# EasyEDA Pro project FIANO.eprj

# Schematic Schematic
Board Name: Split; Create Date: 2024-10-06; Page Name: Schematic; Project Name: FIANO; Schematic Name: Schematic; Update Date: 2024-10-06; File: Plan; Id: /; Sheet: /
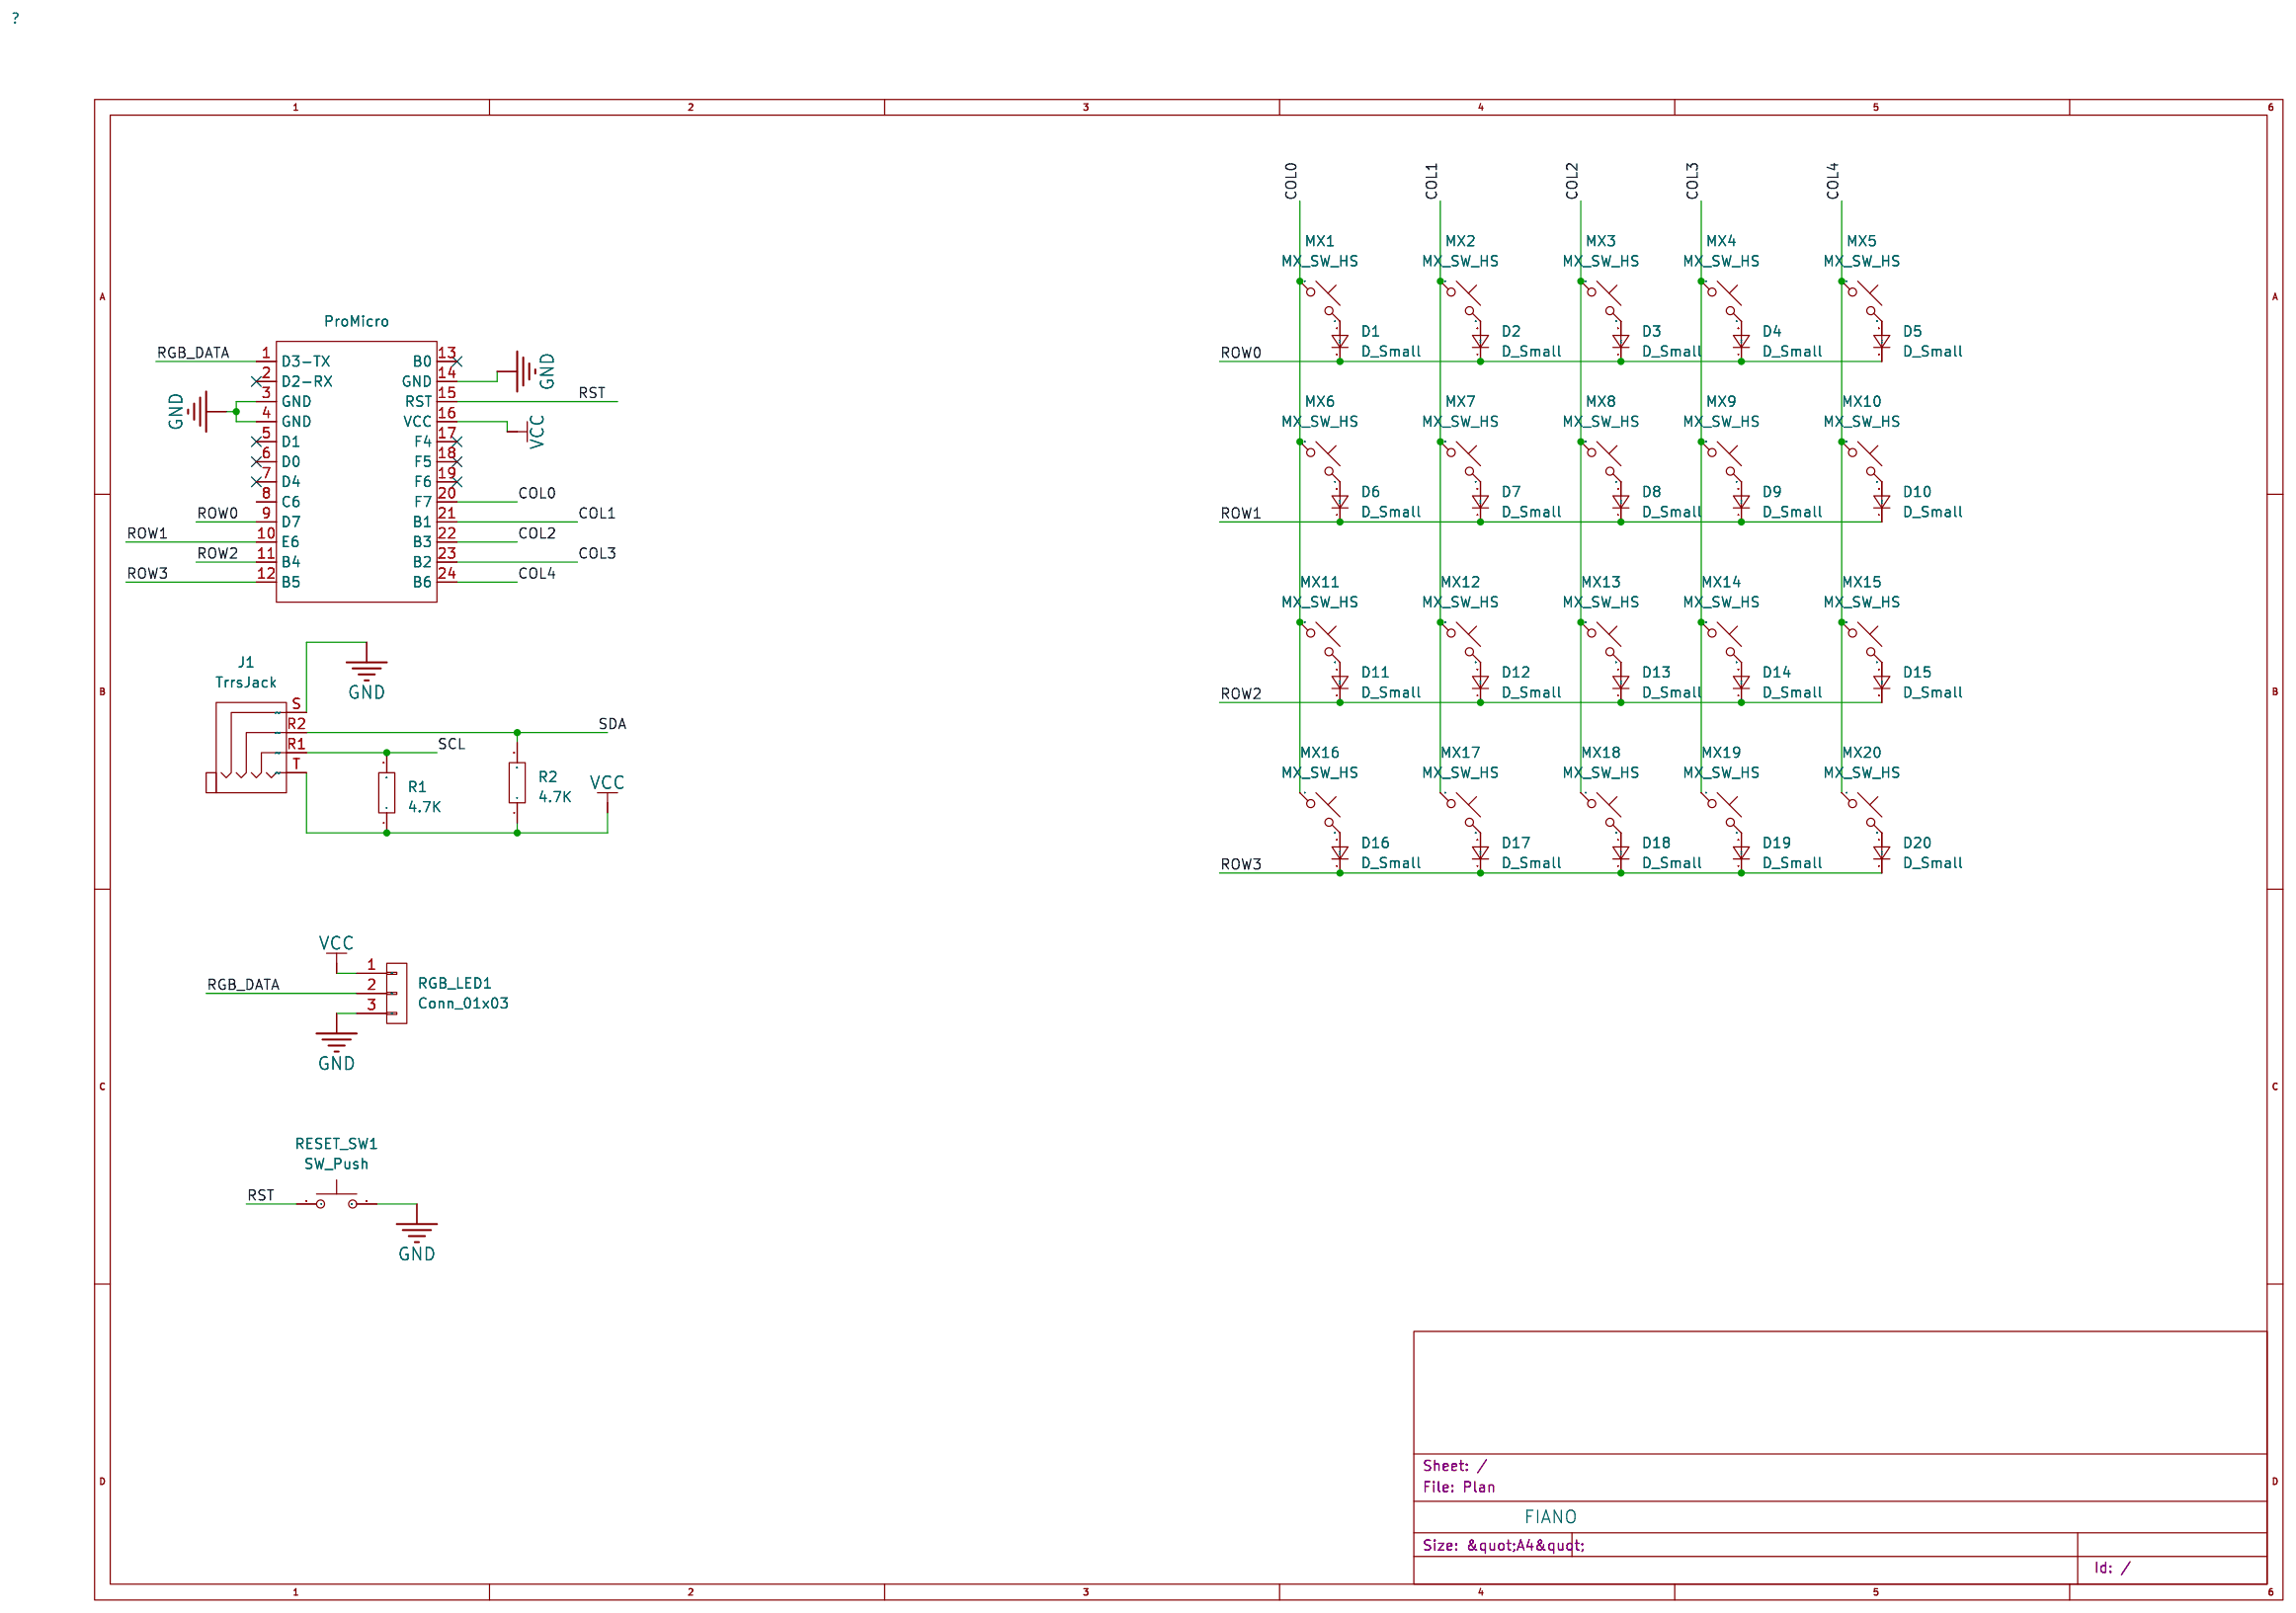
[diagram p0: schematic sheet]

## Parts
D1  D_Small  [Diode_SMD:D_SOD-123]
D2  D_Small  [Diode_SMD:D_SOD-123]
D3  D_Small  [Diode_SMD:D_SOD-123]
D4  D_Small  [Diode_SMD:D_SOD-123]
D5  D_Small  [Diode_SMD:D_SOD-123]
D6  D_Small  [Diode_SMD:D_SOD-123]
D7  D_Small  [Diode_SMD:D_SOD-123]
D8  D_Small  [Diode_SMD:D_SOD-123]
D9  D_Small  [Diode_SMD:D_SOD-123]
D10  D_Small  [Diode_SMD:D_SOD-123]
D11  D_Small  [Keebio-Parts.pretty-master:Diode-hybrid-3pad]
D12  D_Small  [Diode_SMD:D_SOD-123]
D13  D_Small  [Diode_SMD:D_SOD-123]
D14  D_Small  [Diode_SMD:D_SOD-123]
D15  D_Small  [Diode_SMD:D_SOD-123]
D16  D_Small  [Diode_SMD:D_SOD-123]
D17  D_Small  [Diode_SMD:D_SOD-123]
D18  D_Small  [Diode_SMD:D_SOD-123]
D19  D_Small  [Diode_SMD:D_SOD-123]
D20  D_Small  [Diode_SMD:D_SOD-123]
J1  TrrsJack  [PCM_marbastlib-xp-various:CON_MJ-4PP-9]
MX1  MX_SW_HS  [PCM_marbastlib-mx:SW_MX_1u]
MX2  MX_SW_HS  [PCM_marbastlib-mx:SW_MX_1u]
MX3  MX_SW_HS  [PCM_marbastlib-mx:SW_MX_1u]
MX4  MX_SW_HS  [PCM_marbastlib-mx:SW_MX_1u]
MX5  MX_SW_HS  [PCM_marbastlib-mx:SW_MX_1u]
MX6  MX_SW_HS  [PCM_marbastlib-mx:SW_MX_1u]
MX7  MX_SW_HS  [PCM_marbastlib-mx:SW_MX_1u]
MX8  MX_SW_HS  [PCM_marbastlib-mx:SW_MX_1u]
MX9  MX_SW_HS  [PCM_marbastlib-mx:SW_MX_1u]
MX10  MX_SW_HS  [PCM_marbastlib-mx:SW_MX_1u]
MX11  MX_SW_HS  [PCM_marbastlib-mx:SW_MX_1u]
MX12  MX_SW_HS  [PCM_marbastlib-mx:SW_MX_1u]
MX13  MX_SW_HS  [PCM_marbastlib-mx:SW_MX_1u]
MX14  MX_SW_HS  [PCM_marbastlib-mx:SW_MX_1u]
MX15  MX_SW_HS  [PCM_marbastlib-mx:SW_MX_1u]
MX16  MX_SW_HS  [PCM_marbastlib-mx:SW_MX_1u]
MX17  MX_SW_HS  [PCM_marbastlib-mx:SW_MX_1u]
MX18  MX_SW_HS  [PCM_marbastlib-mx:SW_MX_1u]
MX19  MX_SW_HS  [PCM_marbastlib-mx:SW_MX_1u]
MX20  MX_SW_HS  [PCM_marbastlib-mx:SW_MX_1u]
R1  4.7K  [R0603]
R2  4.7K  [R0603]
RESET_SW1  SW_Push
RGB_LED1  Conn_01x03
U1  ProMicro  [PCM_marbastlib-xp-promicroish:ProMicro_USBup]

## Library data of the parts
D1-D20 = Device_D_Small: Diode, small symbol; Sim_Device: D; Sim_Pins: 1=K 2=A; Sim.Device: D; Sim.Pins: 1=K 2=A
J1 = Connector_Audio_AudioJack4: Audio Jack, 4 Poles (TRRS)
MX1-MX20 = PCM_marbastlib-mx_MX_SW_HS_CPG151101S11: Push button switch, normally open, two pins, 45° tilted, Kailh CPG151101S11 for Cherry MX style switches
R1 R2 = Res_0603: Supplier Footprint: 0603
RESET_SW1 = Switch_SW_Push: Push button switch, generic, two pins
RGB_LED1 = Connector_Generic_Conn_01x03: Generic connector, single row, 01x03, script generated (kicad-library-utils/schlib/autogen/connector/)
U1 = PCM_marbastlib-promicroish_Arduino_ProMicro: Symbol for an Arduino Pro Micro

## Nets
GND: J1.S RESET_SW1.2 RGB_LED1.3(Pin) U1.3(GND) U1.4(GND) U1.14(GND)
VCC: J1.T R1.1 R2.1 RGB_LED1.1(Pin) U1.16(VCC)
COL0: MX1.1 MX6.1 MX11.1 MX16.1 U1.20(F7)
COL1: MX2.1 MX7.1 MX12.1 MX17.1 U1.21(B1)
COL2: MX3.1 MX8.1 MX13.1 MX18.1 U1.22(B3)
COL3: MX4.1 MX9.1 MX14.1 MX19.1 U1.23(B2)
COL4: MX5.1 MX10.1 MX15.1 MX20.1 U1.24(B6)
RGB_DATA: RGB_LED1.2(Pin) U1.1(D3-TX)
ROW0: D1.1(K) D2.1(K) D3.1(K) D4.1(K) D5.1(K) U1.9(D7)
ROW1: D6.1(K) D7.1(K) D8.1(K) D9.1(K) D10.1(K) U1.10(E6)
ROW2: D11.1(K) D12.1(K) D13.1(K) D14.1(K) D15.1(K) U1.11(B4)
ROW3: D16.1(K) D17.1(K) D18.1(K) D19.1(K) D20.1(K) U1.12(B5)
RST: RESET_SW1.1 U1.15(RST)
SCL: J1.R1 R1.2
SDA: J1.R2 R2.2
Net-(D1-2): D1.2(A) MX1.2
Net-(D2-2): D2.2(A) MX2.2
Net-(D3-2): D3.2(A) MX3.2
Net-(D4-2): D4.2(A) MX4.2
Net-(D5-2): D5.2(A) MX5.2
Net-(D6-2): D6.2(A) MX6.2
Net-(D7-2): D7.2(A) MX7.2
Net-(D8-2): D8.2(A) MX8.2
Net-(D9-2): D9.2(A) MX9.2
Net-(D10-2): D10.2(A) MX10.2
Net-(D11-2): D11.2(A) MX11.2
Net-(D12-2): D12.2(A) MX12.2
Net-(D13-2): D13.2(A) MX13.2
Net-(D14-2): D14.2(A) MX14.2
Net-(D15-2): D15.2(A) MX15.2
Net-(D16-2): D16.2(A) MX16.2
Net-(D17-2): D17.2(A) MX17.2
Net-(D18-2): D18.2(A) MX18.2
Net-(D19-2): D19.2(A) MX19.2
Net-(D20-2): D20.2(A) MX20.2

Not connected (* = marked no-connect by the designer): U1 2(D2-RX)* 5(D1)* 6(D0)* 7(D4)* 8(C6) 13(B0)* 17(F4)* 18(F5)* 19(F6)*

## Notes on the sheet
- FIANO

# Board Plan
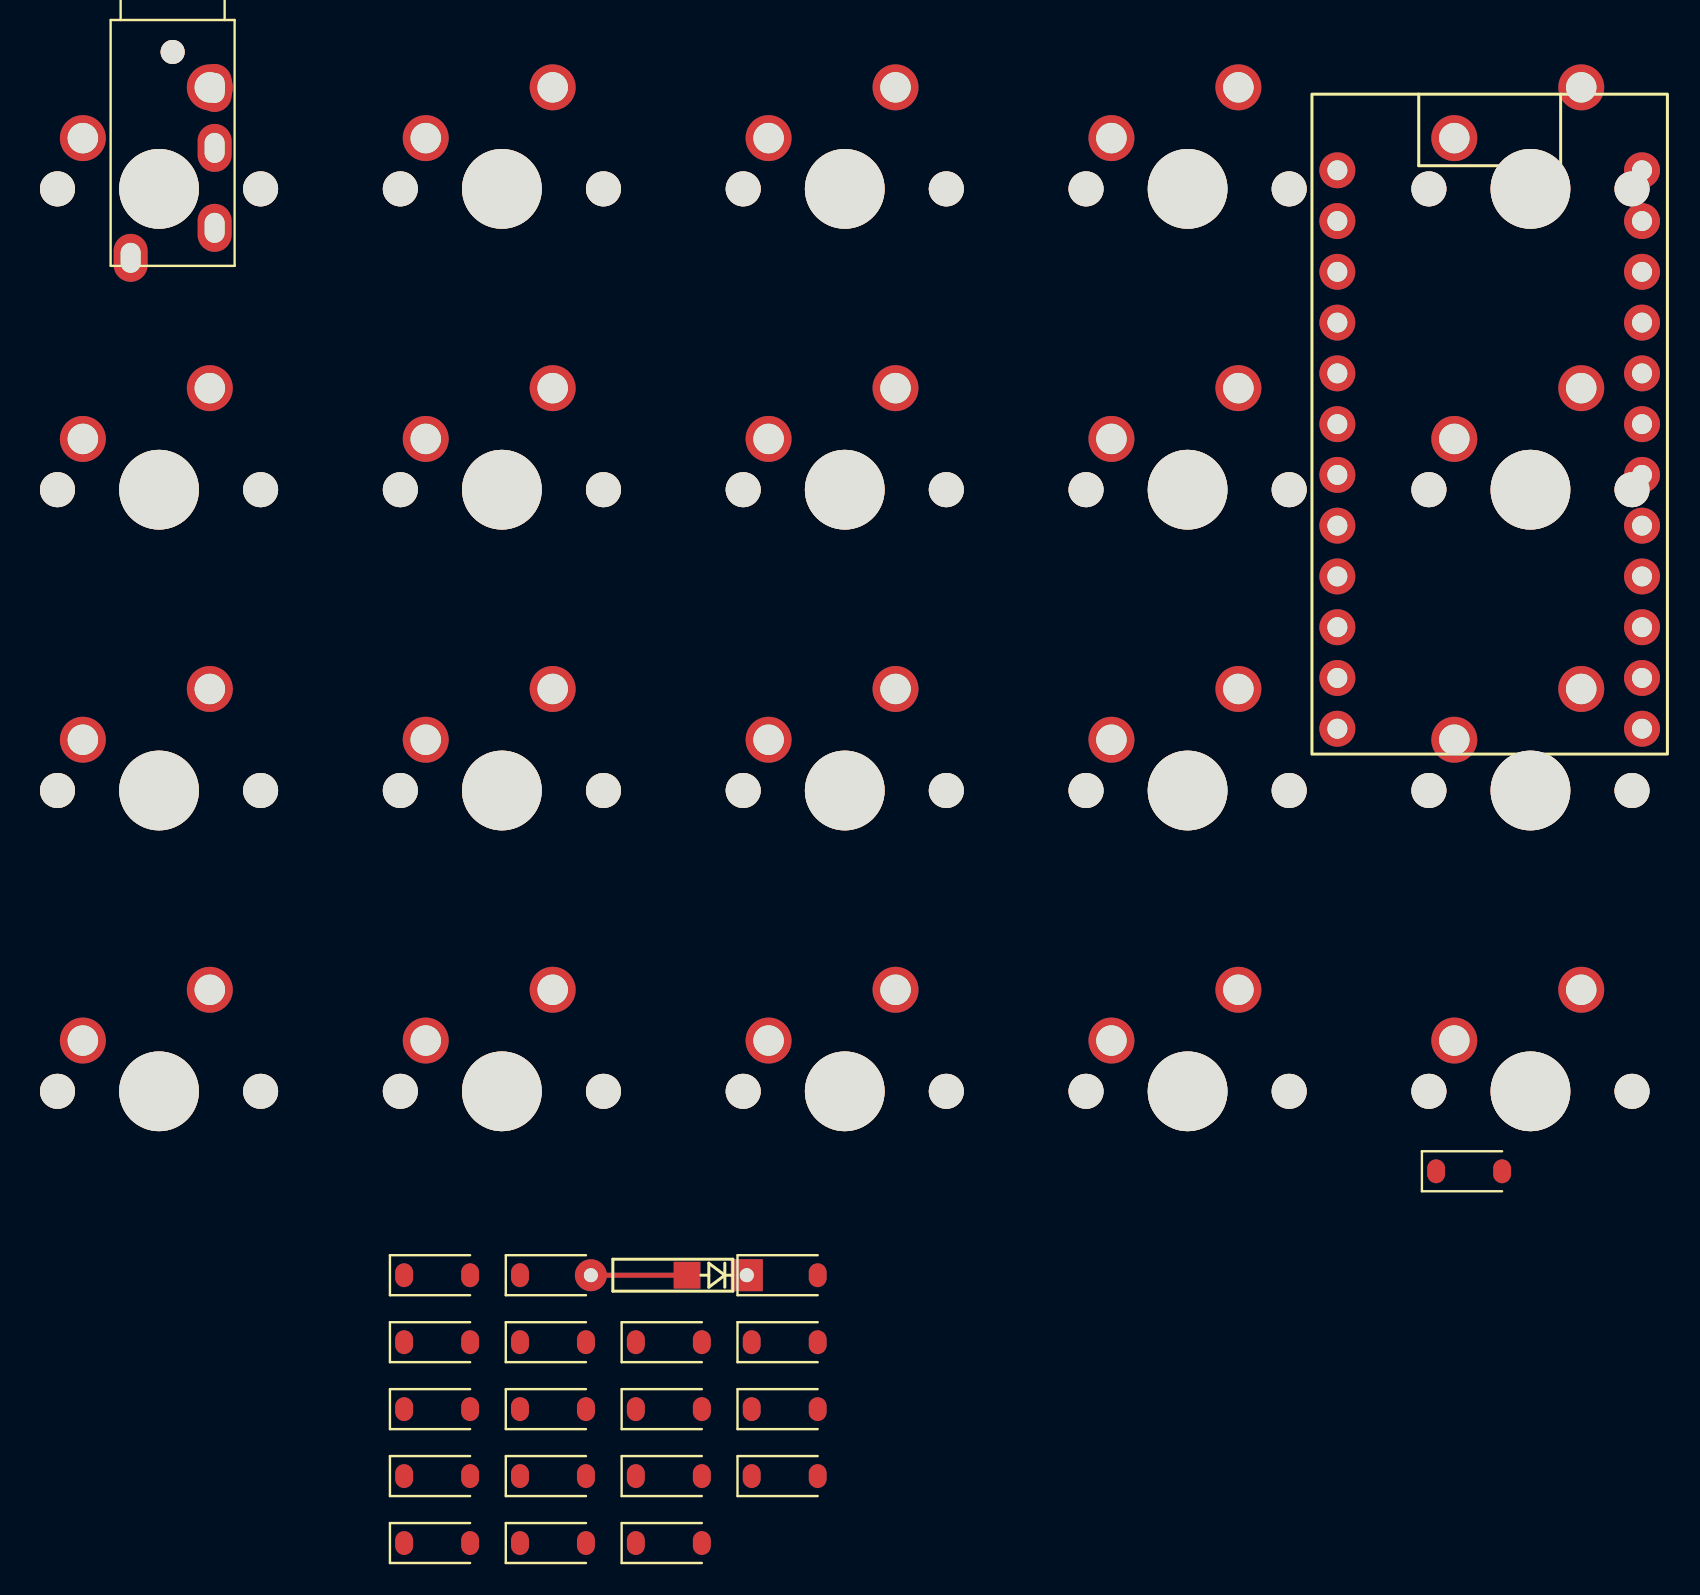
[diagram p1: board, top side]
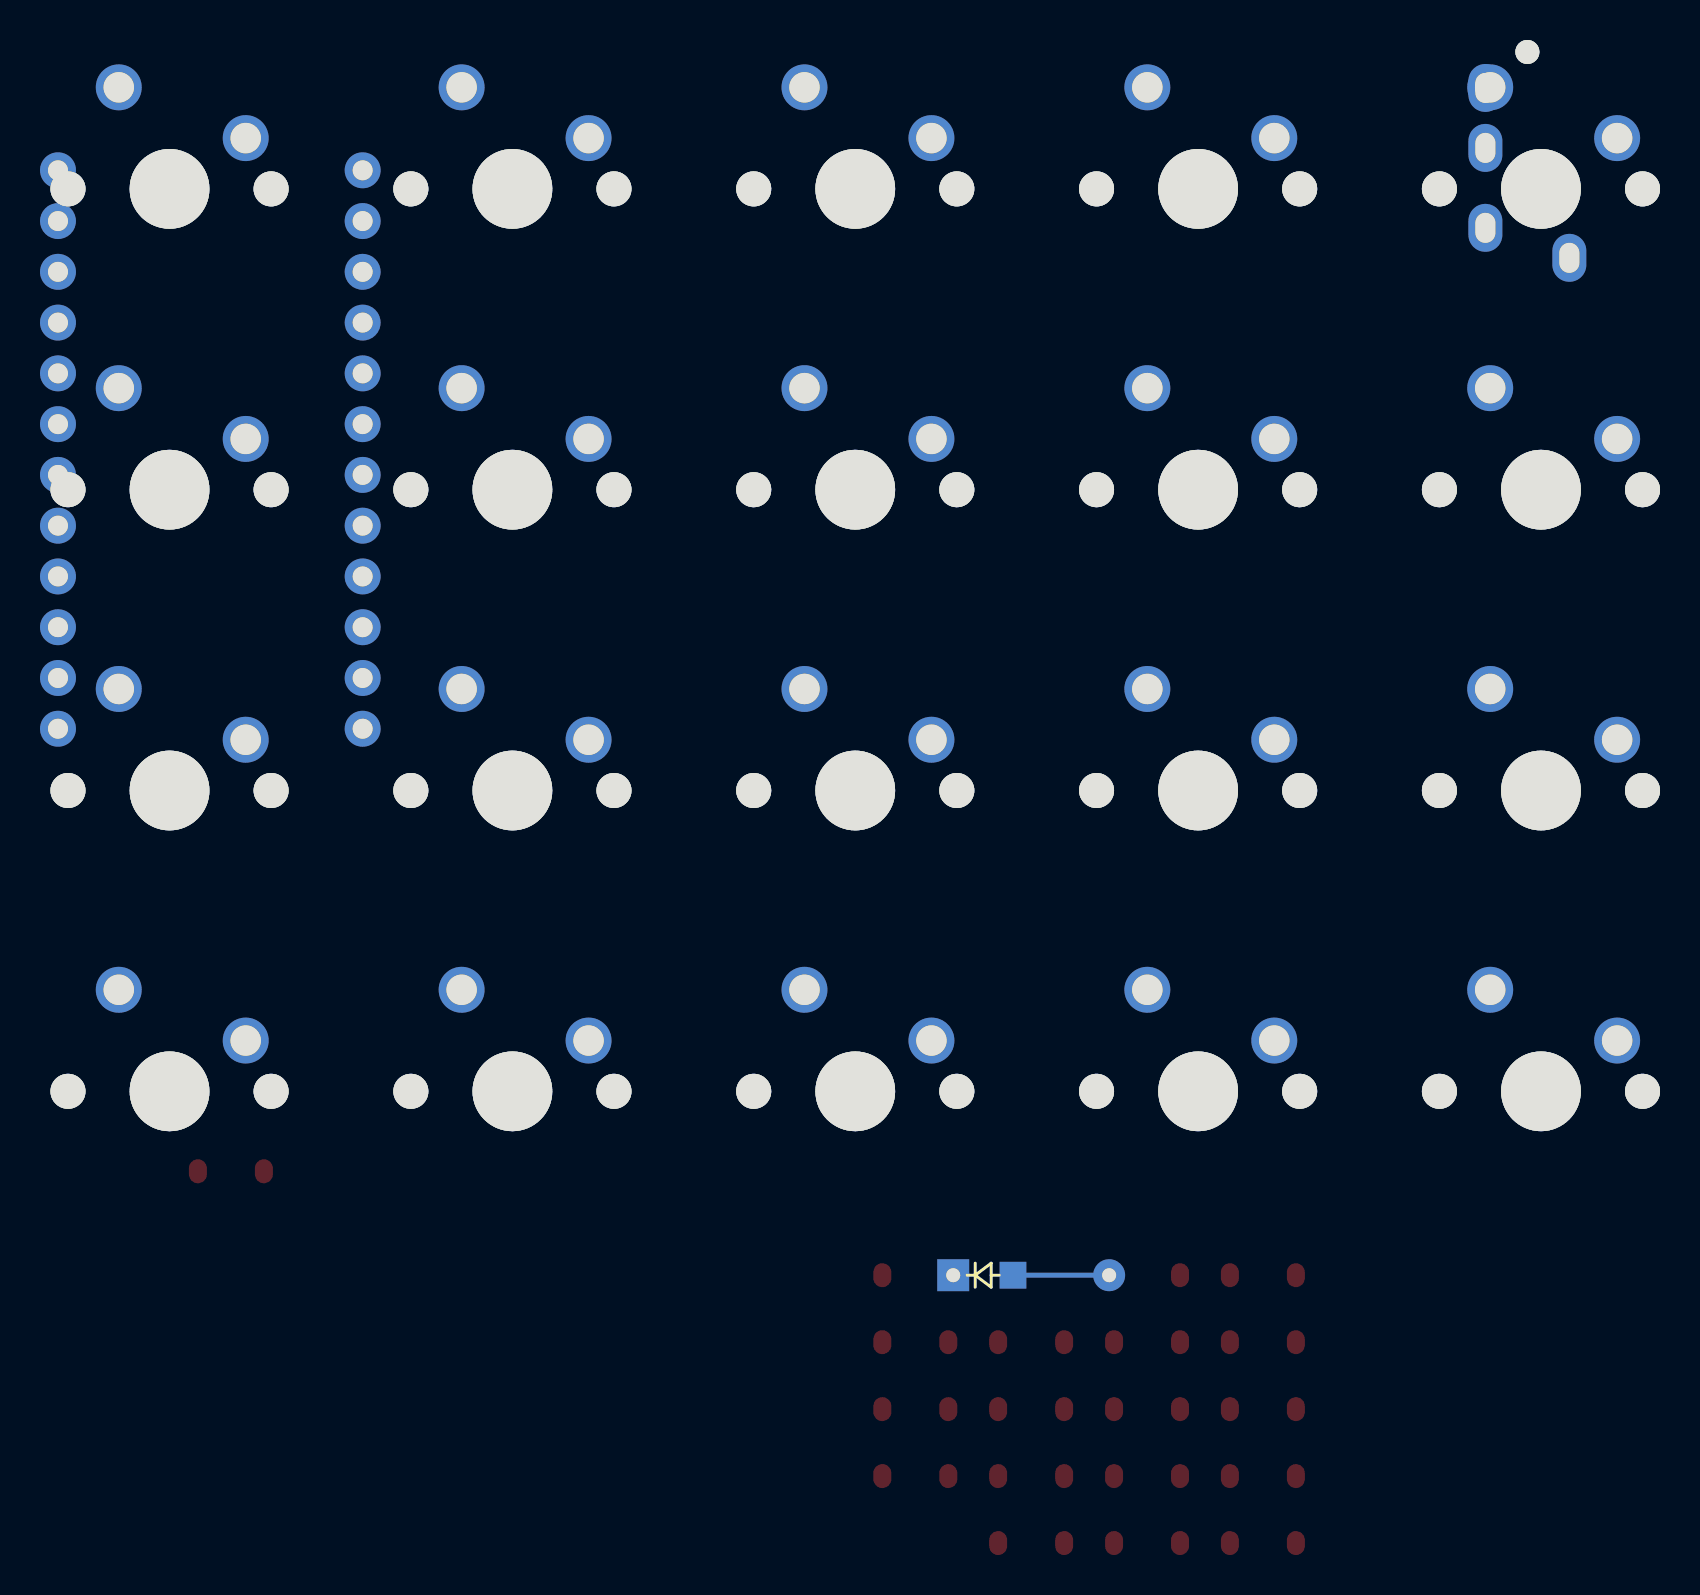
[diagram p2: board, bottom side, seen from below]

No outline. copper layers: Top Layer, Bottom Layer. Coordinates in mm from the lowest, leftmost part position.

## Design rules (mm)
spacing safeClearance (default): track to track 0, other pairs 0 to 0.5

## Placement (name value [footprint] x y rotation side)
D1  D_Small  [Diode_SMD:D_SOD-123]  13.91 13.4 0 top
D2  D_Small  [Diode_SMD:D_SOD-123]  13.91 10.05 0 top
D3  D_Small  [Diode_SMD:D_SOD-123]  13.91 6.7 0 top
D4  D_Small  [Diode_SMD:D_SOD-123]  13.91 3.35 0 top
D5  D_Small  [Diode_SMD:D_SOD-123]  13.91 0 0 top
D6  D_Small  [Diode_SMD:D_SOD-123]  19.7 13.4 0 top
D7  D_Small  [Diode_SMD:D_SOD-123]  19.7 10.05 0 top
D8  D_Small  [Diode_SMD:D_SOD-123]  19.7 6.7 0 top
D9  D_Small  [Diode_SMD:D_SOD-123]  19.7 3.35 0 top
D10  D_Small  [Diode_SMD:D_SOD-123]  19.7 0 0 top
D11  D_Small  [Keebio-Parts.pretty-master:Diode-hybrid-3pad]  25.5 13.4 0 top
D12  D_Small  [Diode_SMD:D_SOD-123]  25.5 10.05 0 top
D13  D_Small  [Diode_SMD:D_SOD-123]  25.5 6.7 0 top
D14  D_Small  [Diode_SMD:D_SOD-123]  25.5 3.35 0 top
D15  D_Small  [Diode_SMD:D_SOD-123]  25.5 0 0 top
D16  D_Small  [Diode_SMD:D_SOD-123]  31.3 13.4 0 top
D17  D_Small  [Diode_SMD:D_SOD-123]  31.3 10.05 0 top
D18  D_Small  [Diode_SMD:D_SOD-123]  31.3 6.7 0 top
D19  D_Small  [Diode_SMD:D_SOD-123]  31.3 3.35 0 top
D20  D_Small  [Diode_SMD:D_SOD-123]  65.53 18.6 0 top
J1  AudioJack4  [PCM_marbastlib-xp-various:CON_MJ-4PP-9]  0.68 70.05 270 top
MX1  MX_SW_HS  [PCM_marbastlib-mx:SW_MX_1u]  0 67.75 0 top
MX2  MX_SW_HS  [PCM_marbastlib-mx:SW_MX_1u]  0 52.7 0 top
MX3  MX_SW_HS  [PCM_marbastlib-mx:SW_MX_1u]  0 37.65 0 top
MX4  MX_SW_HS  [PCM_marbastlib-mx:SW_MX_1u]  0 22.6 0 top
MX5  MX_SW_HS  [PCM_marbastlib-mx:SW_MX_1u]  17.15 67.75 0 top
MX6  MX_SW_HS  [PCM_marbastlib-mx:SW_MX_1u]  17.15 52.7 0 top
MX7  MX_SW_HS  [PCM_marbastlib-mx:SW_MX_1u]  17.15 37.65 0 top
MX8  MX_SW_HS  [PCM_marbastlib-mx:SW_MX_1u]  17.15 22.6 0 top
MX9  MX_SW_HS  [PCM_marbastlib-mx:SW_MX_1u]  34.3 67.75 0 top
MX10  MX_SW_HS  [PCM_marbastlib-mx:SW_MX_1u]  34.3 52.7 0 top
MX11  MX_SW_HS  [PCM_marbastlib-mx:SW_MX_1u]  34.3 37.65 0 top
MX12  MX_SW_HS  [PCM_marbastlib-mx:SW_MX_1u]  34.3 22.6 0 top
MX13  MX_SW_HS  [PCM_marbastlib-mx:SW_MX_1u]  51.45 67.75 0 top
MX14  MX_SW_HS  [PCM_marbastlib-mx:SW_MX_1u]  51.45 52.7 0 top
MX15  MX_SW_HS  [PCM_marbastlib-mx:SW_MX_1u]  51.45 37.65 0 top
MX16  MX_SW_HS  [PCM_marbastlib-mx:SW_MX_1u]  51.45 22.6 0 top
MX17  MX_SW_HS  [PCM_marbastlib-mx:SW_MX_1u]  68.6 67.75 0 top
MX18  MX_SW_HS  [PCM_marbastlib-mx:SW_MX_1u]  68.6 52.7 0 top
MX19  MX_SW_HS  [PCM_marbastlib-mx:SW_MX_1u]  68.6 37.65 0 top
MX20  MX_SW_HS  [PCM_marbastlib-mx:SW_MX_1u]  68.6 22.6 0 top
U2  ProMicro  [PCM_marbastlib-xp-promicroish:ProMicro_USBup]  66.56 54.71 0 top

## Footprints (pads in the part's own frame, mm; a bottom-side part is the same pattern mirrored in y, then rotated)
Diode_SMD:D_SOD-123
  rrect 0.9x1.2 smd: 1(-1.65,0) 2(1.65,0)
Keebio-Parts.pretty-master:Diode-hybrid-3pad
  rect 1.6x1.6 hole 0.7: 1(3.9,0)
  round 1.6 hole 0.7: 2(-3.9,0)
  rect 4x0.25 smd: 2(-1.5,0)
  rect 4x0.25 smd far side: 2(-1.5,0)
  rect 1.34x1.34 smd: 2(0.91,0)
  rect 1.34x1.34 smd far side: 2(0.91,0)
PCM_marbastlib-mx:SW_MX_1u
  round 1.75 hole 1.75: (-5.08,0) (5.08,0)
  round 3.988 hole 3.988: (0,0)
  round 2.3 hole 1.524: 1(-3.81,2.54) 2(2.54,5.08)
PCM_marbastlib-xp-promicroish:ProMicro_USBup
  round 1.8 hole 1: 1(-7.62,13.97) 2(-7.62,11.43) 5(-7.62,3.81) 6(-7.62,1.27) 7(-7.62,-1.27) 8(-7.62,-3.81) 9(-7.62,-6.35) 10(-7.62,-8.89) 11(-7.62,-11.43) 12(-7.62,-13.97) 13(7.62,13.97) 15(7.62,8.89) 16(7.62,6.35) 17(7.62,3.81) 18(7.62,1.27) 19(7.62,-1.27) 20(7.62,-3.81) 21(7.62,-6.35) 22(7.62,-8.89) 23(7.62,-11.43) 24(7.62,-13.97)
  rrect 1.8x1.8 hole 1: 3(-7.62,8.89) 4(-7.62,6.35) 14(7.62,11.43)
PCM_marbastlib-xp-various:CON_MJ-4PP-9
  round 1.2 hole 1.2: (-4.55,0) (2.45,0)
  oval 2.4x1.7 hole 1.5x1: R1(4.25,2.1) R2(0.25,2.1) S(-2.75,2.1) T(5.75,-2.1)

## Nets
GND: J1.S U2.3 U2.4 U2.14
VCC: J1.T U2.16
COL_0: MX1.1 MX6.1 MX11.1 MX16.1 U2.17
COL_1: MX2.1 MX7.1 MX12.1 MX17.1 U2.18
COL_2: MX3.1 MX8.1 MX13.1 MX18.1 U2.19
COL_3: MX4.1 MX9.1 MX14.1 MX19.1 U2.20
COL_4: MX5.1 MX10.1 MX15.1 MX20.1
NET-(D1-A): D1.2 MX1.2
NET-(D2-A): D2.2 MX2.2
NET-(D3-A): D3.2 MX3.2
NET-(D4-A): D4.2 MX4.2
NET-(D5-A): D5.2 MX5.2
NET-(D6-A): D6.2 MX6.2
NET-(D7-A): D7.2 MX7.2
NET-(D8-A): D8.2 MX8.2
NET-(D9-A): D9.2 MX9.2
NET-(D10-A): D10.2 MX10.2
NET-(D11-A): D11.2 MX11.2
NET-(D12-A): D12.2 MX12.2
NET-(D13-A): D13.2 MX13.2
NET-(D14-A): D14.2 MX14.2
NET-(D15-A): D15.2 MX15.2
NET-(D16-A): D16.2 MX16.2
NET-(D17-A): D17.2 MX17.2
NET-(D18-A): D18.2 MX18.2
NET-(D19-A): D19.2 MX19.2
NET-(D20-A): D20.2 MX20.2
RGB_DATA: U2.1
ROW_0: D1.1 D2.1 D3.1 D4.1 D5.1 U2.7
ROW_1: D6.1 D7.1 D8.1 D9.1 D10.1 U2.8
ROW_2: D11.1 D12.1 D13.1 D14.1 D15.1 U2.9
ROW_3: D16.1 D17.1 D18.1 D19.1 D20.1 U2.10
RST: U2.15
SCL: J1.R1 U2.6
SDA: J1.R2 U2.5
UNCONNECTED-(U2-B0-PAD13): U2.13
UNCONNECTED-(U2-B1-PAD21): U2.21
UNCONNECTED-(U2-B2-PAD23): U2.23
UNCONNECTED-(U2-B3-PAD22): U2.22
UNCONNECTED-(U2-B4-PAD11): U2.11
UNCONNECTED-(U2-B5-PAD12): U2.12
UNCONNECTED-(U2-B6-PAD24): U2.24
UNCONNECTED-(U2-D2-RX-PAD2): U2.2
